# Altium project ESP32_Power_Oled_System.PrjPcb
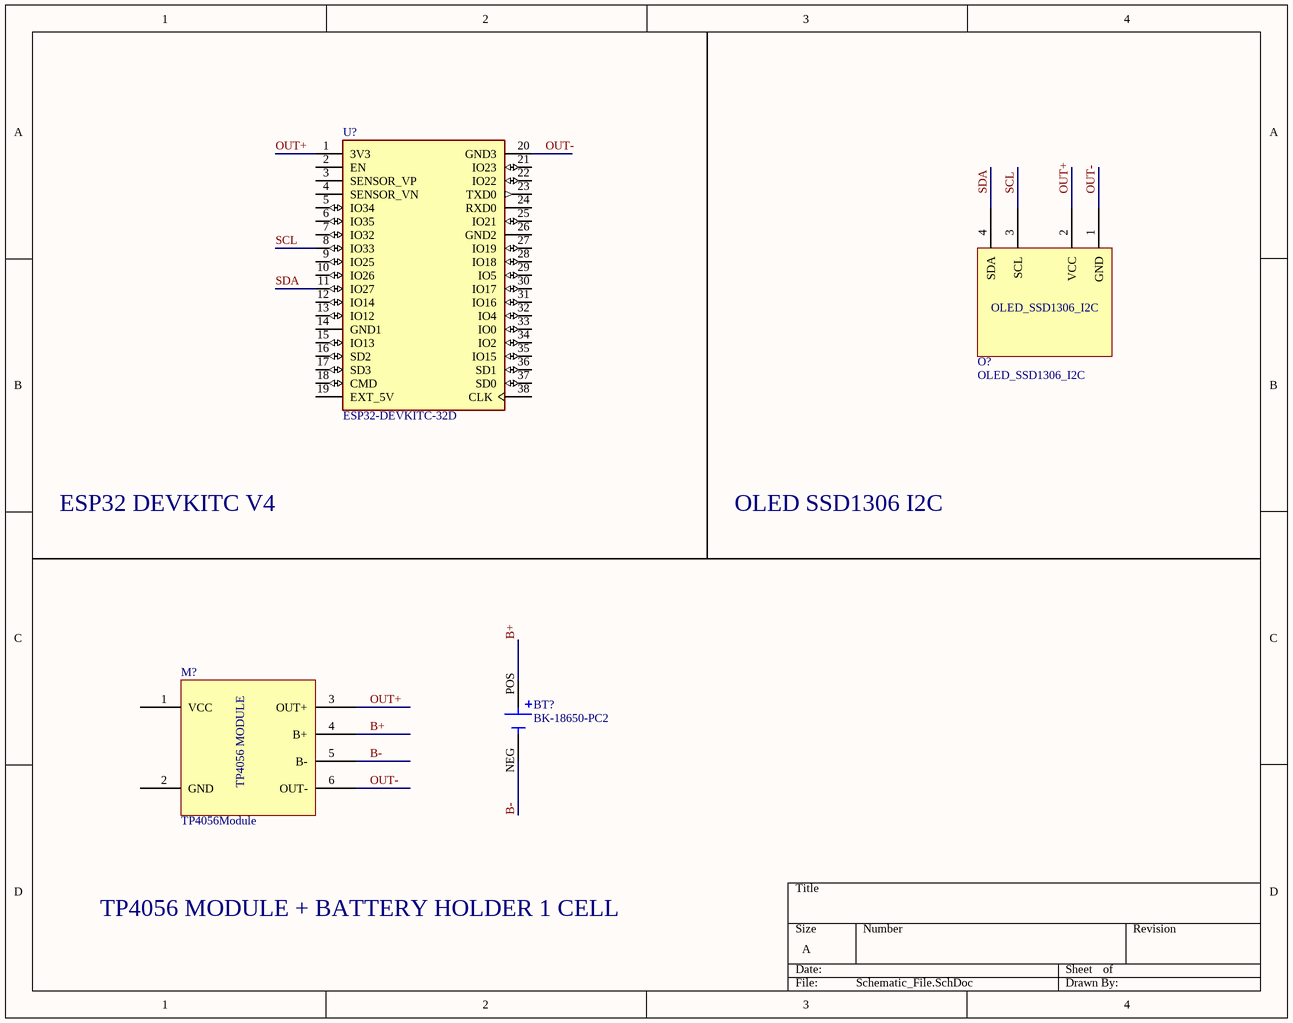
[diagram p0: Schematic_File.SchDoc]
1 sheet, 4 parts. Net scope: global (net labels, ports and power ports of the same name join across sheets).

## Sheet Schematic_File.SchDoc
size A; SheetNumber: 1; SheetTotal: 1

### Parts
BT?  BK-18650-PC2  [BAT_BK-18650-PC2]
M?  TP4056Module  [TP4056Module]
O?  OLED_SSD1306_I2C  [OLED_SSD1306_I2C]
U?  ESP32-DEVKITC-32D  [MODULE_ESP32-DEVKITC-32D]

### Nets
B+: BT?.POS M?.4(B+)
B-: BT?.NEG M?.5(B-)
OUT+: M?.3(OUT+) O?.2(VCC) U?.1(3V3)
OUT-: M?.6(OUT-) O?.1(GND) U?.20(GND3)
SCL: O?.3(SCL) U?.8(IO33)
SDA: O?.4(SDA) U?.11(IO27)

Not connected (* = marked no-connect by the designer): M? 1(VCC) 2(GND); U? 2(EN) 3(SENSOR_VP) 4(SENSOR_VN) 5(IO34) 6(IO35) 7(IO32) 9(IO25) 10(IO26) 12(IO14) 13(IO12) 14(GND1) 15(IO13) 16(SD2) 17(SD3) 18(CMD) 19(EXT_5V) 21(IO23) 22(IO22) 23(TXD0) 24(RXD0) 25(IO21) 26(GND2) 27(IO19) 28(IO18) 29(IO5) 30(IO17) 31(IO16) 32(IO4) 33(IO0) 34(IO2) 35(IO15) 36(SD1) 37(SD0) 38(CLK)

### Notes on the sheet
- ESP32 DEVKITC V4
- OLED SSD1306 I2C
- TP4056 MODULE + BATTERY HOLDER 1 CELL
- (in symbol TP4056Module) TP4056 MODULE

### Library data of the parts
BT? = BK-18650-PC2: Battery Holder (Open) 18650 1 Cell PC Pin; Price: None; Value: *; Package: None; Availability: Unavailable; MP: BK-18650-PC2
M? = TP4056Module: TP4056 Module for managing baterry charging
U? = ESP32-DEVKITC-32D: Eval Board For Esp-Wroom-32; Package: None; Availability: Unavailable; Value: *; MP: ESP32-DEVKITC-32D; Price: None